# Altium schematic sheet USB_Serial_Isolated.SchDoc: USB-Serial Isolated
size A4; Organization: UNSW Solar Racing Team; Address3: UNSW; Address4: Sydney NSW 2052; Address2: Electrical Engineering; Address1: Room 342
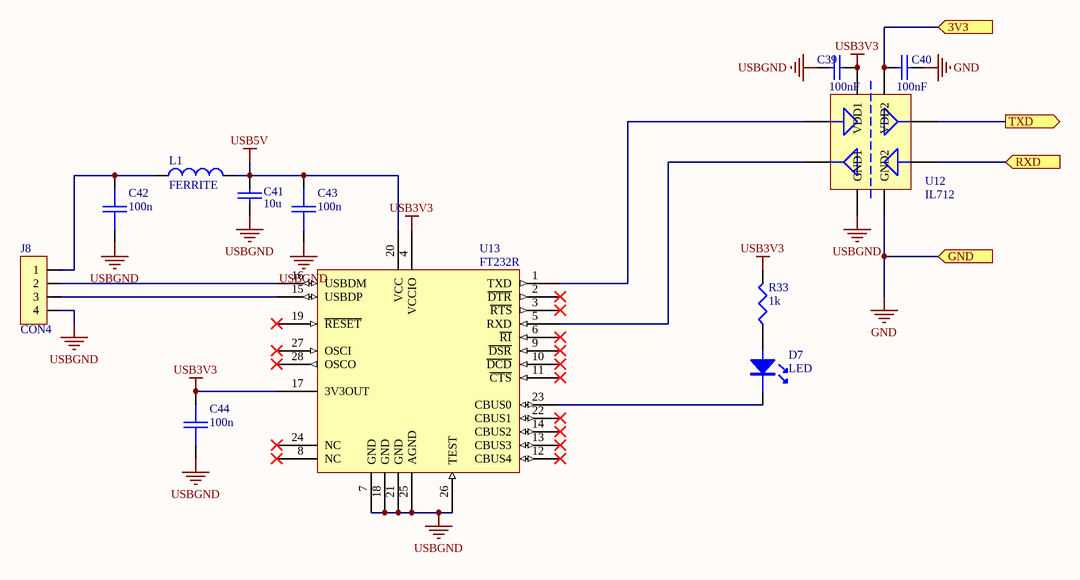
[diagram p0: USB_Serial_Isolated.SchDoc]

## Parts
C39  100nF  [0603]
C40  100nF  [0603]
C41  10u  [0805]
C42  100n  [0603]
C43  100n  [0603]
C44  100n  [0603]
D7  LED  [0805LED]
J8  CON4  [USB_B]
L1  FERRITE  [0805]
R33  1k  [0603]
U12  IL712  [SO8]
U13  FT232R  [SSOP28]

## Ports
3V3 (in), GND (in), RXD (in), TXD (out)

## Nets
GND: C40.2 U12.5(GND2) ; port GND
USB3V3: C39.2 C44.1 R33.2 U12.1(VDD1) U13.4(VCCIO) U13.17(3V3OUT)
USB5V: C41.2 C43.1 L1.2 U13.20(VCC)
USBGND: C39.1 C41.1 C42.2 C43.2 C44.2 J8.4 U12.4(GND1) U13.7(GND) U13.18(GND) U13.21(GND) U13.25(AGND) U13.26(TEST)
3V3: C40.1 U12.8(VDD2) ; port 3V3
RXD: U12.6(IN2) ; port RXD
TXD: U12.7(OUT1) ; port TXD
NetC42_1: C42.1 J8.1 L1.1
NetD7_A: D7.A R33.1
NetD7_K: D7.K U13.23(CBUS0)
NetJ8_2: J8.2 U13.16(USBDM)
NetJ8_3: J8.3 U13.15(USBDP)
NetU12_2: U12.2(IN1) U13.1(TXD)
NetU12_3: U12.3(OUT2) U13.5(RXD)

Not connected (* = marked no-connect by the designer): U13 2(~{DTR})* 3(~{RTS})* 6(~{RI})* 8(NC)* 9(~{DSR})* 10(~{DCD})* 11(~{CTS})* 12(CBUS4)* 13(CBUS3)* 14(CBUS2)* 19(~{RESET})* 22(CBUS1)* 24(NC)* 27(OSCI)* 28(OSCO)*

## Notes on the sheet
- Title
- Size:
- Date:
- A4
- Number:
- Time:
- Revision:
- Sheet
- of
- File:

## Library data of the parts
C39-C44 = CAP: Capacitor
  C39 C40 C42-C44: Farnell: 753-567; Price: 0.31
  C41: Farnell: 521-2820; Price: 0.489
J8 = CON4: Connector; Farnell: 1258768; Price: 4.59
L1 = INDUCTOR: Manufacturer: Generic Components; Class I: Passive; Published: 8-Jun-2000; Revision: July-2002: Re-released for DXP Platform.; Publisher: Altium Limited; Class II: Inductor; Farnell: *; Value: *; Farnell: 323-7977; Price: 0.698
R33 = RES1: Resistor; Farnell: Stock
U12 = IL712: IL712 Optical Isolator
U13 = FT232R: USB UART IC; Farnell: 1146032; Cost: 9.98
D7 = LED: Farnell: *